# Altium schematic sheet SCH Front Pulsadores.SchDoc
size Letter; SheetNumber: 2; SheetTotal: 5
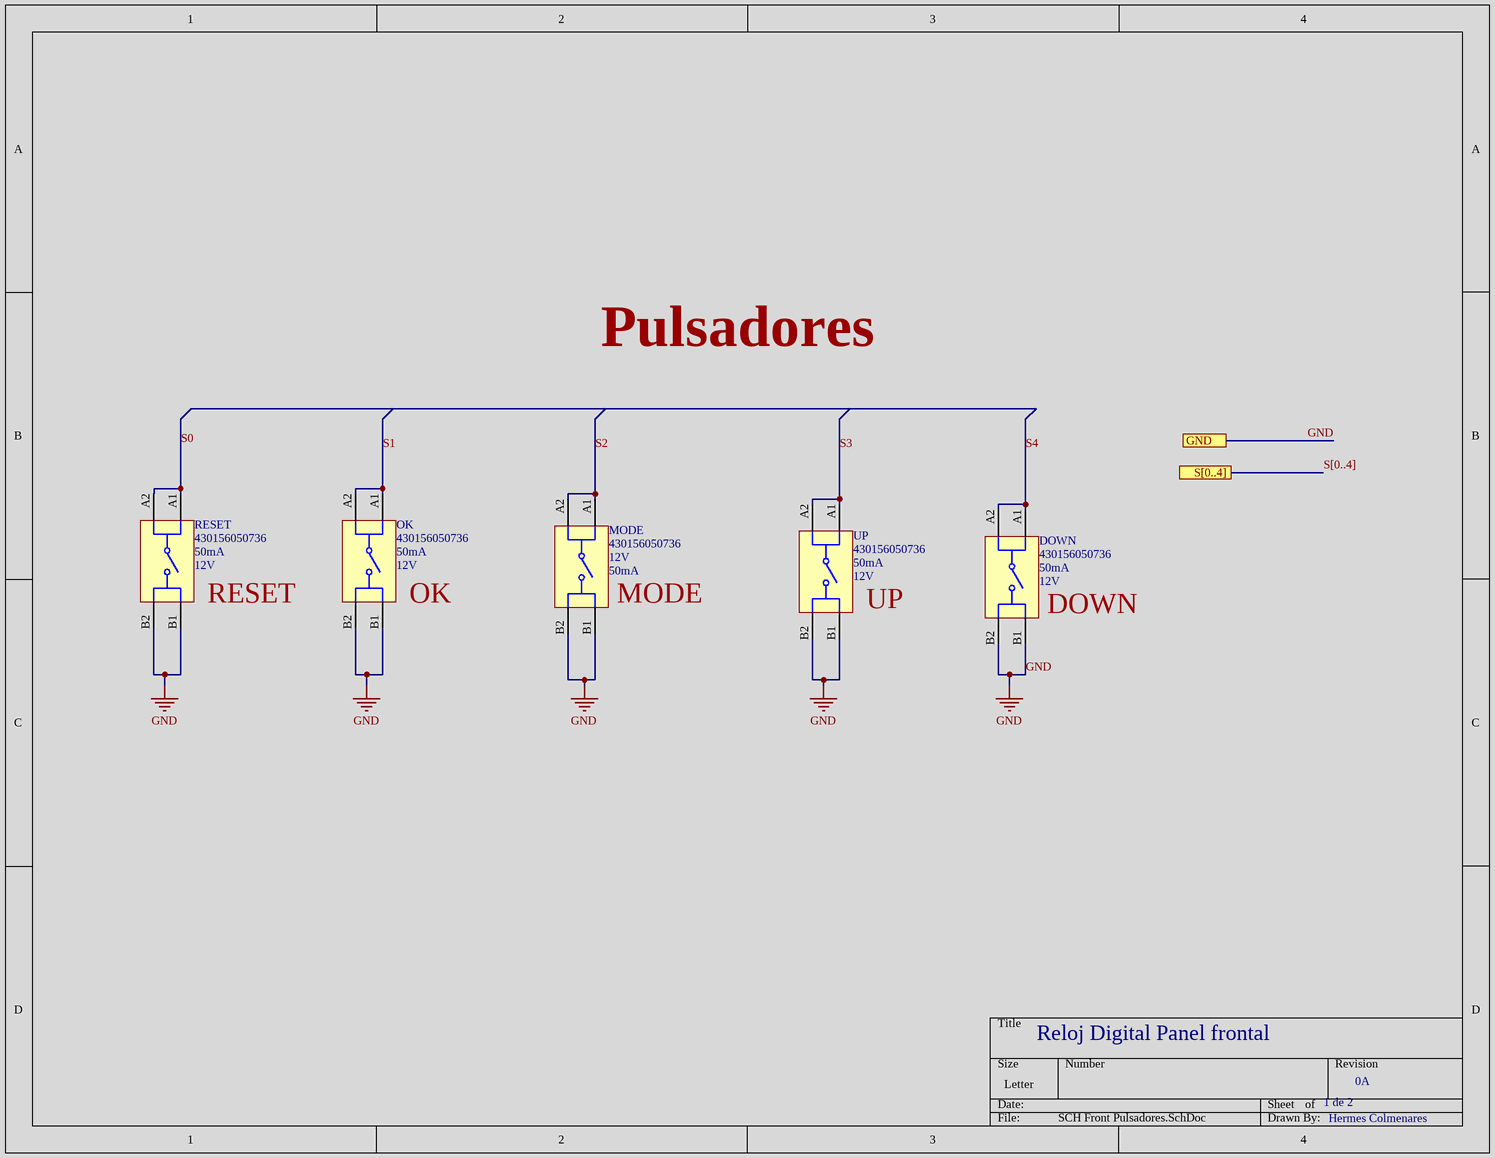
[diagram p0: SCH Front Pulsadores.SchDoc]

## Parts
DOWN  430156050736  Contact Current Rating: 50mA  Voltage Rating: 12V  [4301x60507x6]
MODE  430156050736  Voltage Rating: 12V  Current Rating: 50mA  [4301x60507x6]
OK  430156050736  Contact Current Rating: 50mA  Voltage Rating: 12V  [4301x60507x6]
RESET  430156050736  Contact Current Rating: 50mA  Voltage Rating: 12V  [4301x60507x6]
UP  430156050736  Contact Current Rating: 50mA  Voltage Rating: 12V  [4301x60507x6]

## Ports
GND, S[0..4]

## Nets
GND: DOWN.B1 DOWN.B2 MODE.B1 MODE.B2 OK.B1 OK.B2 RESET.B1 RESET.B2 UP.B1 UP.B2 ; port GND
S0: RESET.A1 RESET.A2
S1: OK.A1 OK.A2
S2: MODE.A1 MODE.A2
S3: UP.A1 UP.A2
S4: DOWN.A1 DOWN.A2

## Buses and harness runs
bus S[0..4] = port S[0..4]

## Notes on the sheet
- Pulsadores
- (near RESET) RESET
- (near OK) OK
- (near MODE) MODE
- (near UP) UP
- (near DOWN) DOWN
- Reloj Digital Panel frontal
- 1 de 2
- 0A
- Hermes Colmenares

## Library data of the parts
DOWN MODE OK RESET UP = CMP-1453-00004-2: NexarPartId: 38794700; Illumination Type: Illuminated, Non-Illuminated; Mechanical Life: 200kcycles; Actuator Material: Liquid Crystal Polymer, Polymer; Throw Configuration: SPST; Insulation Resistance: 100MΩ; Switch Function: Off-Mom; Switch Travel: 250µm; Height: 5mm; RoHS: Compliant; Width: 6.2mm; Contact Material: Steel; Max Operating Temperature: 85°C; Mount: Through Hole; REACH SVHC: No SVHC; Termination: PC Pin; Min Operating Temperature: -40°C; Length: 6.2mm; Diameter: 3.5mm; Packaging: Bulk; Contact Plating: Silver
  DOWN OK RESET UP: Current Rating: 50mA
  MODE: Contact Current Rating: 50mA